# EasyEDA Pro project ProDoc_遥控_2025-09-02.epro

# Schematic Schematic1
Board Name: 遥控; Create Date: 2024-12-08; Page Name: P1; Project Name: 兽装可动眼（商用版）; Schematic Name: Schematic1; Update Date: 2024-12-22
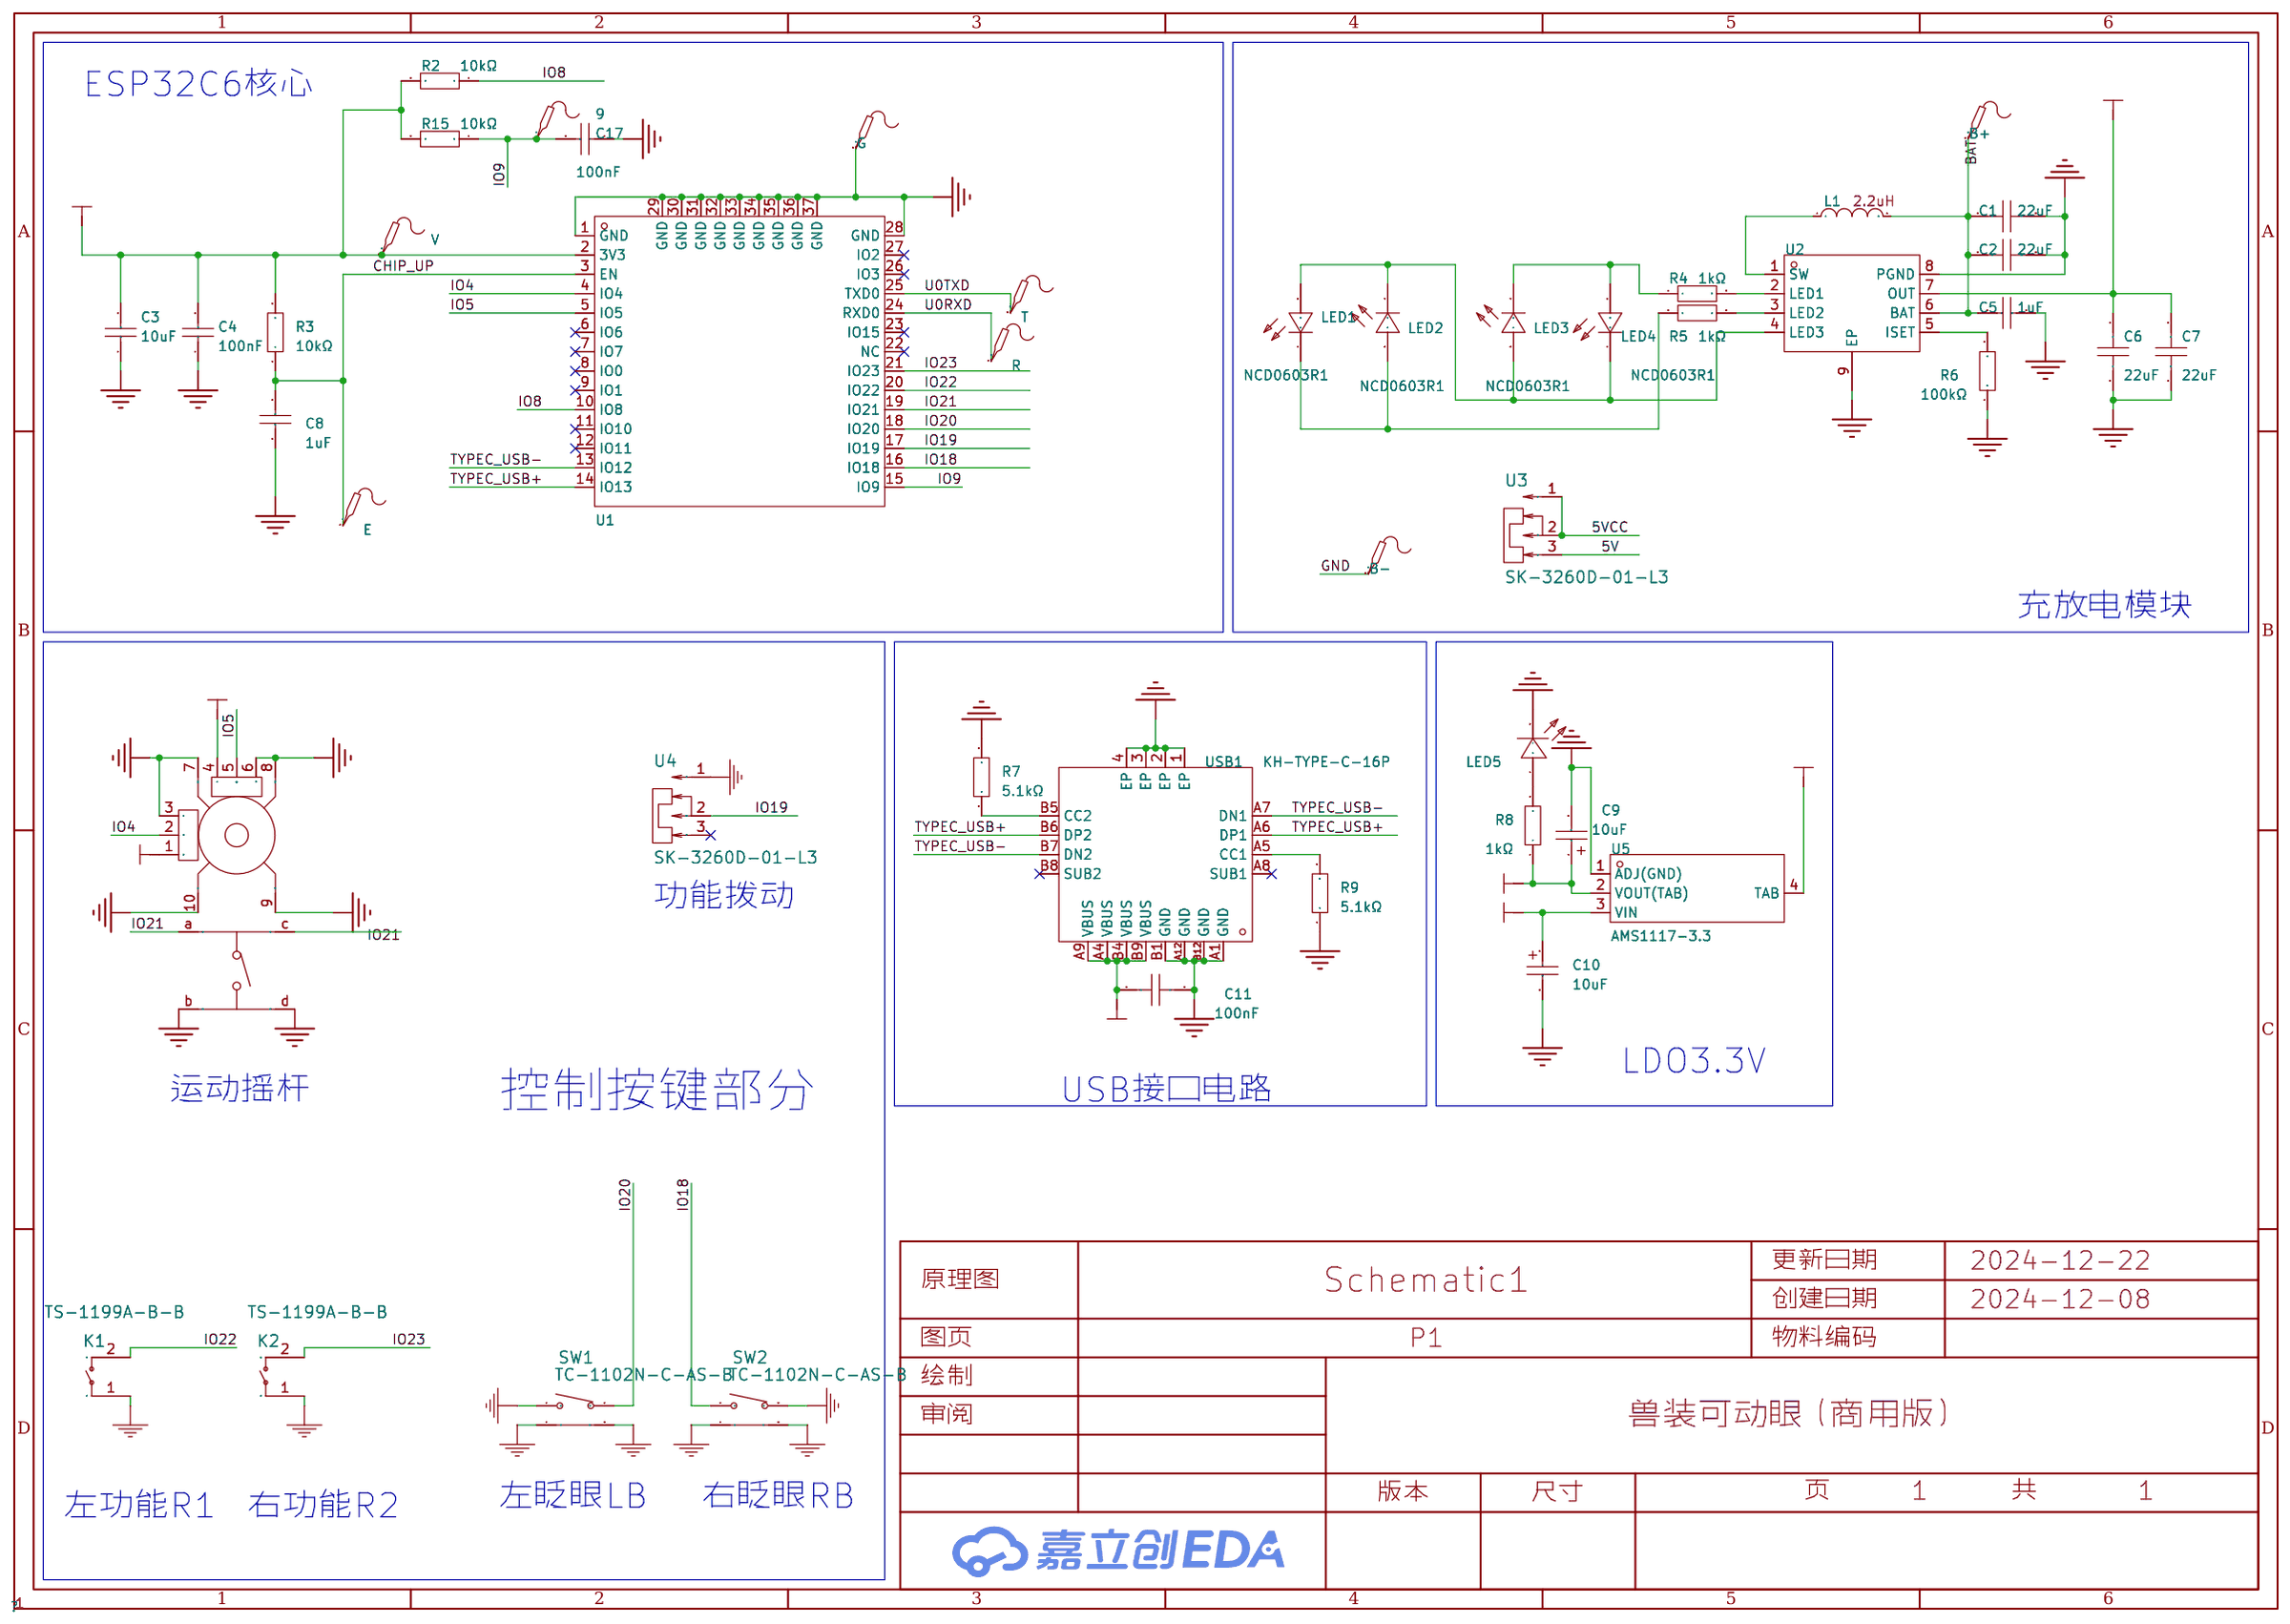
[diagram p0: schematic sheet]

## Parts
9  -  [Test-Point-0.5mm]
B+  -  [Test-Point-0.5mm]
B-  -  [Test-Point-0.5mm]
C1  22uF  [C0805]
C2  22uF  [C0805]
C3  10uF  [C0805]
C4  100nF  [C0805]
C5  1uF  [C0603]
C6  22uF  [C0805]
C7  22uF  [C0805]
C8  1uF  [C0805]
C9  10uF  [CAP-SMD_L3.2-W1.6-RD-C7171]
C10  10uF  [CAP-SMD_L3.2-W1.6-RD-C7171]
C11  100nF  [C0603]
C17  100nF  [C0805]
E  -  [Test-Point-0.5mm]
G  -  [Test-Point-0.5mm]
JOY1  RKJXV1224005  [SW-TH_RKJXV1224005]
K1  TS-1199A-B-B  [SW-SMD_L6.0-W6.0-P6.00-LS6.6]
K2  TS-1199A-B-B  [SW-SMD_L6.0-W6.0-P6.00-LS6.6]
L1  2.2uH  [IND-SMD_L5.8-W5.2]
LED1  NCD0603R1  [LED0603-RD_RED]
LED2  NCD0603R1  [LED0603-RD_RED]
LED3  NCD0603R1  [LED0603-RD_RED]
LED4  NCD0603R1  [LED0603-RD_RED]
LED5  NCD0805R1  [LED0805-R-RD]
R  -  [Test-Point-0.5mm]
R2  10kΩ  [R0805]
R3  10kΩ  [R0805]
R4  1kΩ  [R0603]
R5  1kΩ  [R0603]
R6  100kΩ  [R0603]
R7  5.1kΩ  [R0603]
R8  1kΩ  [R0805]
R9  5.1kΩ  [R0603]
R15  10kΩ  [R0805]
SW1  TC-1102N-C-AS-B  [SW-TH_TC-1102N-C-AS-B]
SW2  TC-1102N-C-AS-B  [SW-TH_TC-1102N-C-AS-B]
T  -  [Test-Point-0.5mm]
U1  ESP32-C6-WROOM-1-N8  [WIRELM-SMD_ESP32-C6-WROOM-1]
U2  ETA9740  [ESOP-8_L4.9-W3.9-P1.27-LS6.0-BL-EP]
U3  SK-3260D-01-L3  [SW-TH_SK-3260D-01-LX]
U4  SK-3260D-01-L3  [SW-TH_SK-3260D-01-LX]
U5  AMS1117-3.3  [SOT-223-4_L6.5-W3.5-P2.30-LS7.0-BR]
USB1  KH-TYPE-C-16P  [USB-C-SMD_KH-TYPE-C-16P]
V  -  [Test-Point-0.5mm]

## Library data of the parts
9 B+ B- E G R T V = Test-Point: Test Point 测试点
C1 C2 C6 C7 = CL21A226MAQNNNE_C45783: 容值:22uF;精度:±20%;额定电压:25V;材质(温度系数):X5R;; LCSC Part Name: 22uF ±20% 25V; Supplier Part: C45783; Manufacturer: SAMSUNG(三星); Manufacturer Part: CL21A226MAQNNNE; Supplier Footprint: 0805; JLCPCB Part Class: Basic Part; Datasheet: https://atta.szlcsc.com/upload/public/pdf/source/20160103/1457707727161.pdf; Supplier: LCSC; Tolerance: ±20%; Voltage Rated: 25V; Temperature Coefficient: X5R
C3 = CL21A106KOQNNNE: 容值:10uF;精度:±10%;额定电压:16V;材质(温度系数):X5R;; LCSC Part Name: 10uF ±10% 16V; Supplier Part: C1713; Manufacturer: SAMSUNG(三星); Supplier Footprint: 0805; JLCPCB Part Class: 扩展库; Datasheet: https://atta.szlcsc.com/upload/public/pdf/source/20160103/1457707694240.pdf; Supplier: LCSC; Tolerance: ±10%; Voltage Rated: 16V; Temperature Coefficient: X5R
C4 C17 = 0805B104K500NT: 容值:100nF;精度:±10%;额定电压:50V;材质(温度系数):X7R;; LCSC Part Name: 100nF ±10% 50V; Supplier Part: C38141; Manufacturer: FH(风华); Supplier Footprint: 0805; JLCPCB Part Class: 扩展库; Datasheet: https://atta.szlcsc.com/upload/public/pdf/source/20170923/C38141_1506149447419988747.pdf; Supplier: LCSC; Tolerance: ±10%; Voltage Rated: 50V; Temperature Coefficient: X7R
C5 = CL10A105KB8NNNC: 容值:1uF;精度:±10%;额定电压:50V;材质(温度系数):X5R;; LCSC Part Name: 1uF ±10% 50V; Supplier Part: C15849; Manufacturer: SAMSUNG(三星); Supplier Footprint: 0603; JLCPCB Part Class: Basic Part; Datasheet: https://atta.szlcsc.com/upload/public/pdf/source/20160103/1457707679084.pdf; Supplier: LCSC; Tolerance: ±10%; Voltage Rated: 50V; Temperature Coefficient: X5R
C8 = CL21B105KBFNNNE: 容值:1uF;精度:±10%;额定电压:50V;材质(温度系数):X7R;; LCSC Part Name: 1uF ±10% 50V; Supplier Part: C28323; Manufacturer: SAMSUNG(三星); Supplier Footprint: 0805; JLCPCB Part Class: 基础库; Datasheet: https://atta.szlcsc.com/upload/public/pdf/source/20160103/1457707718219.pdf; Supplier: LCSC; Tolerance: ±10%; Voltage Rated: 50V; Temperature Coefficient: X7R
C9 C10 = TAJA106K016RNJ: 容值:10uF;精度:±10%;额定电压:16V;等效串联电阻:3Ω@100kHz;; LCSC Part Name: 10uF ±10% 16V; Supplier Part: C7171; Manufacturer: Kyocera AVX; Supplier Footprint: CASE-A-3216; JLCPCB Part Class: 基础库; Datasheet: https://atta.szlcsc.com/upload/public/pdf/source/20160107/1457707748093.pdf; Supplier: LCSC; Tolerance: ±10%; Rated Voltage: 16V; Equivalent Series Resistance(ESR): 3Ω@100kHz; Operating Temperature: -55℃~+125℃
C11 = CC0603KRX7R9BB104: 容值:100nF;精度:±10%;额定电压:50V;材质(温度系数):X7R;; LCSC Part Name: 100nF ±10% 50V; Supplier Part: C14663; Manufacturer: YAGEO(国巨); Supplier Footprint: 0603; JLCPCB Part Class: 基础库; Datasheet: https://atta.szlcsc.com/upload/public/pdf/source/20180910/C282072_33301C7F631E79921B82A8DAC6BCC5B3.pdf; Supplier: LCSC; Tolerance: ±10%; Voltage Rated: 50V; Temperature Coefficient: X7R
JOY1 = RKJXV1224005: 操纵杆复位 中央按动开关 适用于航模玩具遥控器电位器、3D摇杆PS4手柄游戏机、无人机摇杆电位器、工业控制器; Supplier Part: C146170; Manufacturer: ALPSALPINE(阿尔卑斯阿尔派); Supplier Footprint: 插件,13x13mm; JLCPCB Part Class: Extended Part; Datasheet: https://atta.szlcsc.com/upload/public/pdf/source/20180125/C146170_15168615510911301620.pdf; Supplier: LCSC
K1 K2 = TS-1199A-B-B: 电路结构:单刀单掷;按钮形状:圆形按钮;作用力:200gf;安装方式:立贴;开关长度:6mm;开关宽度:6mm;开关高度:5mm;带支架:不带;触点电流:50mA;额定电压(DC):12V;绝缘电阻:-;带灯:无;机械寿命:10万次;; LCSC Part Name: 6*6*5mm 立贴 轻触开关; Supplier Part: C692476; Manufacturer: XKB Connectivity(中国星坤); Supplier Footprint: SMD; JLCPCB Part Class: Extended Part; Datasheet: https://atta.szlcsc.com/upload/public/pdf/source/20211011/5E46F02732EE66B7CDC1B0DB682D7B62.pdf; Supplier: LCSC; Circuit: 单刀单掷; Actuator Style: 圆形按钮; Operating Force: 200gf; Mounting Style: 立贴; Switch Length: 6mm; Switch Width: 6mm; Switch Height: 5mm; Strike Gundam: 不带; Contact Current: 50mA; Voltage Rating (DC): 12V; Actuator/Cap Color: 黑色; With Lamp: 无; Mechanical Life: 10万次; Operating Temperature: -30℃~+85℃
L1 = MDA5030-2R2M: 电感值:2.2uH;精度:±20%;额定电流:6.5A;饱和电流(Isat):6.5A;直流电阻(DCR):21.6mΩ;; LCSC Part Name: 2.2uH ±20% 6.5A; Supplier Part: C2847475; Manufacturer: KOHERelec(科或); Supplier Footprint: SMD,5.2x5.7mm; JLCPCB Part Class: Extended Part; Datasheet: https://atta.szlcsc.com/upload/public/pdf/source/20210806/C2847475_BCA7949AA3147D213A746F6BA524684A.pdf; Supplier: LCSC; Tolerance: ±20%; Rated Current: 6.5A; Saturation Current (Isat): 6.5A; DC Resistance (DCR): 21.6mΩ; Length: 5.8mm; Width: 5.2mm; Height: 4.5mm
LED1-LED4 = NCD0603R1_C84263: 灯头类型:-;发光颜色:红色;正向电压(VF):1.6V~2.6V;功率:65mW;正向电流:20mA;主波长:615nm~630nm;二极管配置:独立二极管;透镜颜色:无色透明透镜;色温:-;发光强度:80mcd~220mcd;发光角度:130°;载带方式:-;工作温度:-30℃~+85℃;; Supplier Part: C84263; Manufacturer: 国星光电; Supplier Footprint: 0603; JLCPCB Part Class: Extended Part; Datasheet: https://atta.szlcsc.com/upload/public/pdf/source/20200820/C84263_DABC6A75E58F576973B407FDBA283D60.pdf; Supplier: LCSC; Emitted Color: 红色; Forward Voltage (VF): 1.6V~2.6V; Power Dissipation: 65mW; Forward Current: 20mA; Dominant Wavelength: 615nm~630nm; Diode Configuration: 独立二极管; Lens Color: 无色透明透镜; Luminous Intensity: 80mcd~220mcd; Viewing Angle: 130°; Operating Temperature: -30℃~+85℃
LED5 = NCD0805R1: 灯头类型:-;发光颜色:红色;正向电压(VF):1.6V~2.6V;功率:65mW;正向电流:20mA;主波长:615nm~630nm;二极管配置:独立二极管;透镜颜色:无色透明透镜;色温:-;发光强度:67mcd~195mcd;发光角度:130°;载带方式:-;工作温度:-30℃~+85℃;; Supplier Part: C84256; Manufacturer: 国星光电; Supplier Footprint: 0805; JLCPCB Part Class: Basic Part; Datasheet: https://atta.szlcsc.com/upload/public/pdf/source/20200820/C84256_F0A75A43B3EAD75808600A0514C76B99.pdf; Supplier: LCSC; Emitted Color: 红色; Forward Voltage (VF): 1.6V~2.6V; Power Dissipation: 65mW; Forward Current: 20mA; Dominant Wavelength: 615nm~630nm; Diode Configuration: 独立二极管; Lens Color: 无色透明透镜; Luminous Intensity: 67mcd~195mcd; Viewing Angle: 130°; Operating Temperature: -30℃~+85℃
R2 R3 R15 = 0805W8F1002T5E_C17414: 电阻类型:厚膜电阻;阻值:10kΩ;精度:±1%;功率:125mW;; LCSC Part Name: 10kΩ ±1% 125mW; Supplier Part: C17414; Manufacturer: UNI-ROYAL(厚声); Manufacturer Part: 0805W8F1002T5E; Supplier Footprint: 0805; JLCPCB Part Class: 基础库; Datasheet: https://atta.szlcsc.com/upload/public/pdf/source/20200306/C422600_1E6D84923E4A46A82E41ADD87F860B5C.pdf; Supplier: LCSC; Type: 厚膜电阻; Tolerance: ±1%; Power(Watts): 125mW; Temperature Coefficient: ±100ppm/℃; Overload Voltage (Max): 150V; Operating Temperature Range: -55℃~+155℃
R4 R5 = 0603WAF1001T5E: 电阻类型:厚膜电阻;阻值:1kΩ;精度:±1%;功率:100mW;; LCSC Part Name: 1kΩ ±1% 100mW; Supplier Part: C21190; Manufacturer: UNI-ROYAL(厚声); Supplier Footprint: 0603; JLCPCB Part Class: Basic Part; Datasheet: https://atta.szlcsc.com/upload/public/pdf/source/20200306/C422600_1E6D84923E4A46A82E41ADD87F860B5C.pdf; Supplier: LCSC; Type: 厚膜电阻; Tolerance: ±1%; Power(Watts): 100mW; Temperature Coefficient: ±100ppm/℃; Overload Voltage (Max): 75V; Operating Temperature Range: -55℃~+155℃
R6 = 0603WAF1003T5E: 电阻类型:厚膜电阻;阻值:100kΩ;精度:±1%;功率:100mW;; LCSC Part Name: 100kΩ ±1% 100mW; Supplier Part: C25803; Manufacturer: UNI-ROYAL(厚声); Supplier Footprint: 0603; JLCPCB Part Class: Basic Part; Datasheet: https://atta.szlcsc.com/upload/public/pdf/source/20200306/C422600_1E6D84923E4A46A82E41ADD87F860B5C.pdf; Supplier: LCSC; Type: 厚膜电阻; Tolerance: ±1%; Power(Watts): 100mW; Temperature Coefficient: ±100ppm/℃; Overload Voltage (Max): 75V; Operating Temperature Range: -55℃~+155℃
R7 R9 = 0603WAF5101T5E: 电阻类型:厚膜电阻;阻值:5.1kΩ;精度:±1%;功率:100mW;最大工作电压:75V;温度系数:±100ppm/℃;; LCSC Part Name: 5.1kΩ ±1% 100mW 厚膜电阻; Supplier Part: C23186; Manufacturer: UNI-ROYAL(厚声); Supplier Footprint: 0603; JLCPCB Part Class: 基础库; Datasheet: https://atta.szlcsc.com/upload/public/pdf/source/20200306/C422600_1E6D84923E4A46A82E41ADD87F860B5C.pdf; Supplier: LCSC; Type: 厚膜电阻; Tolerance: ±1%; Power(Watts): 100mW; Overload Voltage (Max): 75V; Temperature Coefficient: ±100ppm/℃; Operating Temperature Range: -55℃~+155℃
R8 = RC0805FR-071KL: 电阻类型:厚膜电阻;阻值:1kΩ;精度:±1%;功率:125mW;; LCSC Part Name: 1kΩ ±1% 125mW; Supplier Part: C95781; Manufacturer: YAGEO(国巨); Supplier Footprint: 0805; JLCPCB Part Class: 扩展库; Datasheet: https://atta.szlcsc.com/upload/public/pdf/source/20170228/1488267679154.pdf; Supplier: LCSC; Type: 厚膜电阻; Tolerance: ±1%; Power(Watts): 125mW; Temperature Coefficient: ±100ppm/℃; Overload Voltage (Max): 150V; Operating Temperature Range: -55℃~+155℃
SW1 SW2 = TC-1102N-C-AS-B: 电路结构:单刀单掷;按钮形状:圆形按钮;作用力:260gf;安装方式:卧插;开关长度:6mm;开关宽度:6mm;开关高度:4.5mm;带支架:带支架;触点电流:50mA;额定电压(DC):12V;绝缘电阻:-;带灯:无;机械寿命:30万次;; LCSC Part Name: 6*6*4.5mm 卧插 轻触开关; Supplier Part: C406151; Manufacturer: XKB Connectivity(中国星坤); Supplier Footprint: 插件; JLCPCB Part Class: Extended Part; Datasheet: https://atta.szlcsc.com/upload/public/pdf/source/20211011/8943A334D21548136505FDDC6F7285B9.pdf; Supplier: LCSC; Circuit: 单刀单掷; Actuator Style: 圆形按钮; Operating Force: 260gf; Mounting Style: 卧插; Switch Length: 6mm; Switch Width: 6mm; Switch Height: 4.5mm; Strike Gundam: 带支架; Contact Current: 50mA; Voltage Rating (DC): 12V; Actuator/Cap Color: 黑色; With Lamp: 无; Pin Style: PC引脚; Mechanical Life: 30万次; Operating Temperature: -30℃~+85℃
U1 = ESP32-C6-WROOM-1-N8: Supplier Part: C5366877; Manufacturer: ESPRESSIF(乐鑫); JLCPCB Part Class: Extended Part; Datasheet: https://atta.szlcsc.com/upload/public/pdf/source/20241030/28A96DE7ADA92974C13AF543C219F785.pdf; Supplier: LCSC
U2 = ETA9740: Supplier Part: C2892884; Supplier Footprint: ESOP-8EP(4.9x3.9x1.27); JLCPCB Part Class: 扩展库; Datasheet: 2021-09-02/679003A/644f31485bf644619c02e5e95628f4a9/20160908126263.pdf; Supplier: LCSC
U3 U4 = SK-3260D-01-L3: 电路结构:单刀双掷;安装方式:侧插;开关颜色:黑色;额定电流(DC):50mA;额定电压(DC):12V;额定电流(AC):50mA;额定电压(AC):12V;机械寿命:1万次;; LCSC Part Name: 柄长3mm 卧插双档 滑动开关; Supplier Part: C692482; Manufacturer: XKB Connectivity(中国星坤); Supplier Footprint: 插件; JLCPCB Part Class: Extended Part; Datasheet: https://atta.szlcsc.com/upload/public/pdf/source/20211009/221EDC0F79A971BF29F08D53B29B73D7.pdf; Supplier: LCSC; Circuit: 单刀双掷; Actuator Style: 矩形柱状; Pin Style: PC引脚; Switch Length: 9mm; Switch Width: 3.2mm; Switch Height: 3.6mm; Mounting Style: 侧插; Actuator Color: 黑色; Current Rating (DC): 50mA; Voltage Rating (DC): 12V; Current Rating (AC): 50mA; Voltage Rating (AC): 12V; Mechanical Life: 1万次; Operating Temperature: -40℃~+85℃
U5 = AMS1117-3.3_C347222: 输出类型:固定;最大输入电压:18V;输出电压:3.3V;输出电流:1A;电源纹波抑制比(PSRR):60dB@(120Hz);输出极性:正极;; LCSC Part Name: 输出:3.3V 电流:1A 耐压:12V; Supplier Part: C347222; Manufacturer: UMW(友台半导体); Supplier Footprint: SOT-223; JLCPCB Part Class: Extended Part; Datasheet: https://atta.szlcsc.com/upload/public/pdf/source/20231109/155D79A26D9DB04352555A58D5969DC8.pdf; Supplier: LCSC; Output Type: 固定; Output Polarity: 正极; Number of Outputs: 1; Maximum Input Voltage: 18V; Output Voltage: 3.3V; Dropout Voltage: 1.3V@(1A); Output Current: 1A; Power Supply Rejection Ratio (PSRR): 60dB@(120Hz); Feature: 过流保护(OCP)
USB1 = KH-TYPE-C-16P: 连接器类型:Type-C;标准:-;公母:母座;触点数量:16;端口数量:1;安装方式:卧贴;额定电流 - 电源:3A;工作温度范围:-40℃~+85℃;; LCSC Part Name: Type-C 母座 卧贴; Supplier Part: C709357; Manufacturer: kinghelm(金航标); Supplier Footprint: SMD; JLCPCB Part Class: 扩展库; Datasheet: https://atta.szlcsc.com/upload/public/pdf/source/20200911/C709357_AA8DCEB38BB20E3035A7ED7AE7667837.pdf; Supplier: LCSC; Connector Type: Type-C; Gender: 母座; Number of Contacts: 16; Number of Ports: 1; Mounting Style: 卧贴; Current Rating - Power (Max): 3A; Operating Temperature Range: -40℃~+85℃

## Nets
3V3: C3.2 C4.2 C9.1 JOY1.1(B) JOY1.4(A) R2.2 R3.2 R8.1 R15.2 U1.2(3V3) U5.2(VOUT(TAB)) U5.4(TAB) V.1
5V: C6.1 C7.2 C11.2 U2.7(OUT) U3.3 USB1.A4(VBUS) USB1.A9(VBUS) USB1.B4(VBUS) USB1.B9(VBUS)
5VCC: C10.1 U3.1 U3.2 U5.3(VIN)
GND: B-.1 C1.2 C2.2 C3.1 C4.1 C5.2 C6.2 C7.1 C8.1 C9.2 C10.2 C11.1 C17.1 G.1 JOY1.3(A) JOY1.6(B) JOY1.7(GND) JOY1.8(GND) JOY1.9(GND) JOY1.10(GND) JOY1.b JOY1.d K1.1 K2.1 LED5.2(-) R6.1 R7.2 R9.1 SW1.1 SW1.3 SW1.4 SW2.2 SW2.3 SW2.4 U1.1(GND) U1.28(GND) U1.29(GND) U1.30(GND) U1.31(GND) U1.32(GND) U1.33(GND) U1.34(GND) U1.35(GND) U1.36(GND) U1.37(GND) U2.8(PGND) U2.9(EP) U4.1 U5.1(ADJ(GND)) USB1.1(EP) USB1.2(EP) USB1.3(EP) USB1.4(EP) USB1.A1(GND) USB1.A12(GND) USB1.B1(GND) USB1.B12(GND)
BAT: B+.1 C1.1 C2.1 C5.1 L1.2 U2.6(BAT)
CHIP_UP: C8.2 E.1 R3.1 U1.3(EN)
IO4: JOY1.2(DTA) U1.4(IO4)
IO5: JOY1.5(DTA) U1.5(IO5)
IO8: R2.1 U1.10(IO8)
IO9: 9.1 C17.2 R15.1 U1.15(IO9)
IO18: SW2.1 U1.16(IO18)
IO19: U1.17(IO19) U4.2
IO20: SW1.2 U1.18(IO20)
IO21: JOY1.a JOY1.c U1.19(IO21)
IO22: K1.2 U1.20(IO22)
IO23: K2.2 U1.21(IO23)
TYPEC_USB+: U1.14(IO13) USB1.A6(DP1) USB1.B6(DP2)
TYPEC_USB-: U1.13(IO12) USB1.A7(DN1) USB1.B7(DN2)
U0RXD: R.1 U1.24(RXD0)
U0TXD: T.1 U1.25(TXD0)
$1N2410: LED5.1(+) R8.2
$1N3847: R9.2 USB1.A5(CC1)
$1N3906: R7.1 USB1.B5(CC2)
$1N6588: R6.2 U2.5(ISET)
$1N6592: R5.2 U2.3(LED2)
$1N6593: LED1.1(K) LED2.2(A) R5.1
$1N6594: L1.1 U2.1(SW)
$1N6595: LED1.2(A) LED2.1(K) LED3.2(A) LED4.1(K) U2.4(LED3)
$1N6596: LED3.1(K) LED4.2(A) R4.1
$1N6597: R4.2 U2.2(LED1)

Not connected (* = marked no-connect by the designer): U1 6(IO6)* 7(IO7)* 8(IO0)* 9(IO1)* 11(IO10)* 12(IO11)* 22(NC)* 23(IO15)* 26(IO3)* 27(IO2)*; U4 3*; USB1 A8(SUB1)* B8(SUB2)*

## Notes on the sheet
- ESP32C6核心
- 充放电模块
- 功能拨动
- LDO3.3V
- 运动摇杆
- 控制按键部分
- USB接口电路
- 左功能R1
- 右功能R2
- 左眨眼LB
- 右眨眼RB

# Board PCB1
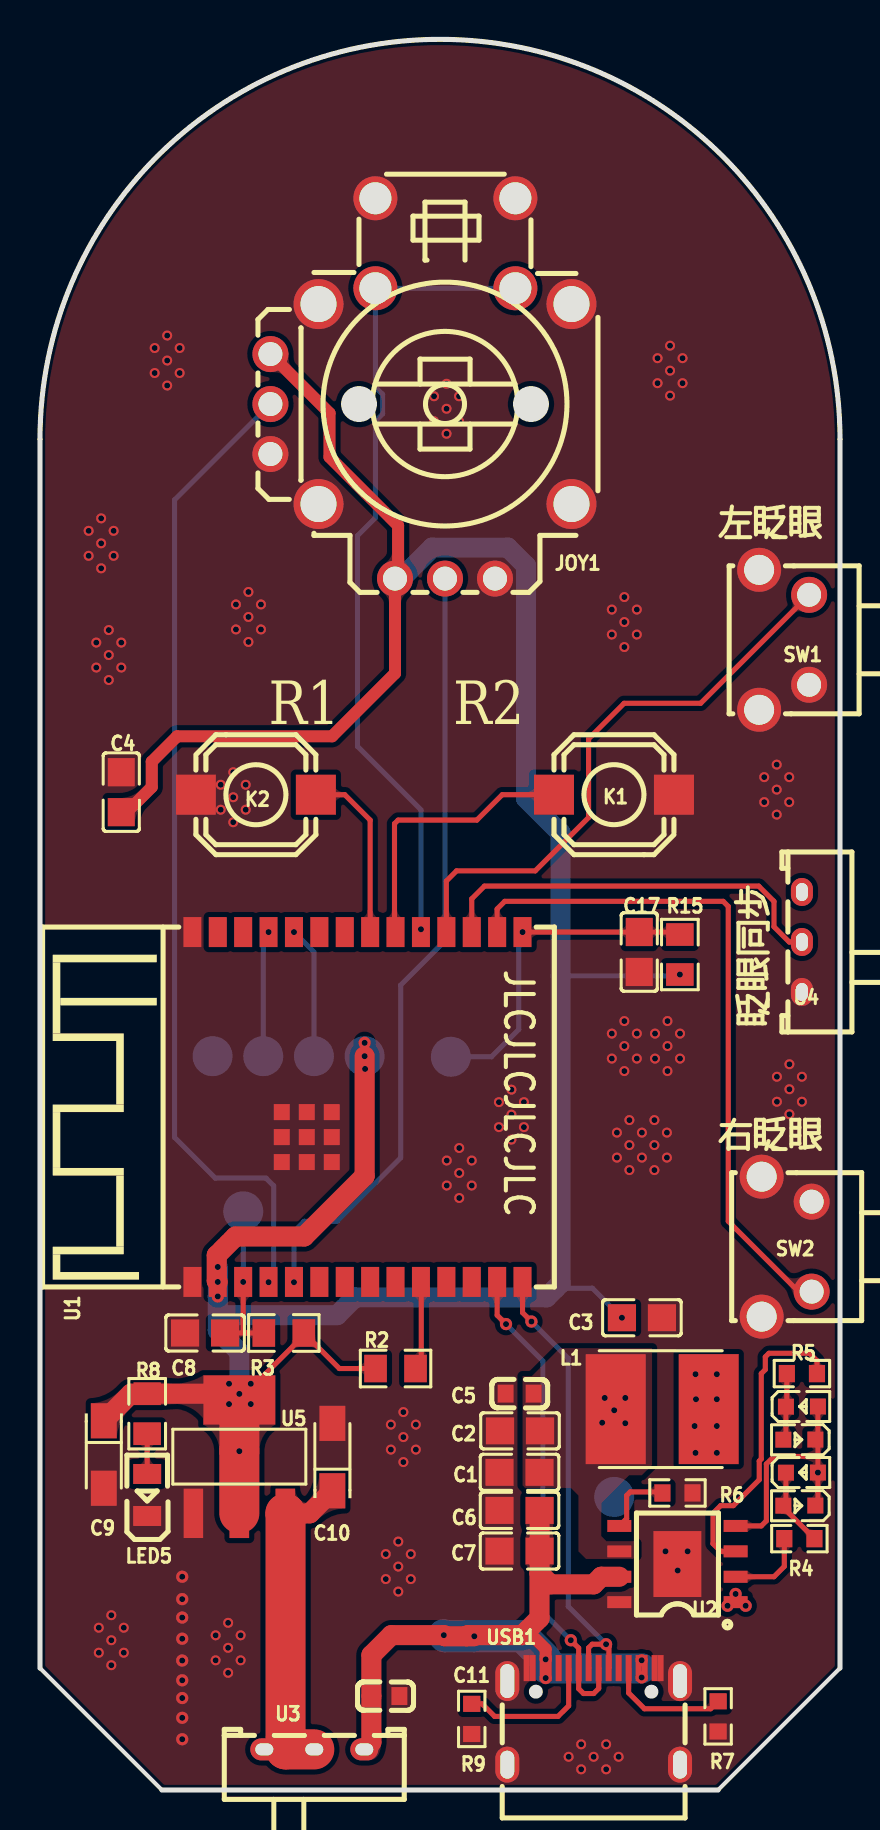
[diagram p1: board, top side]
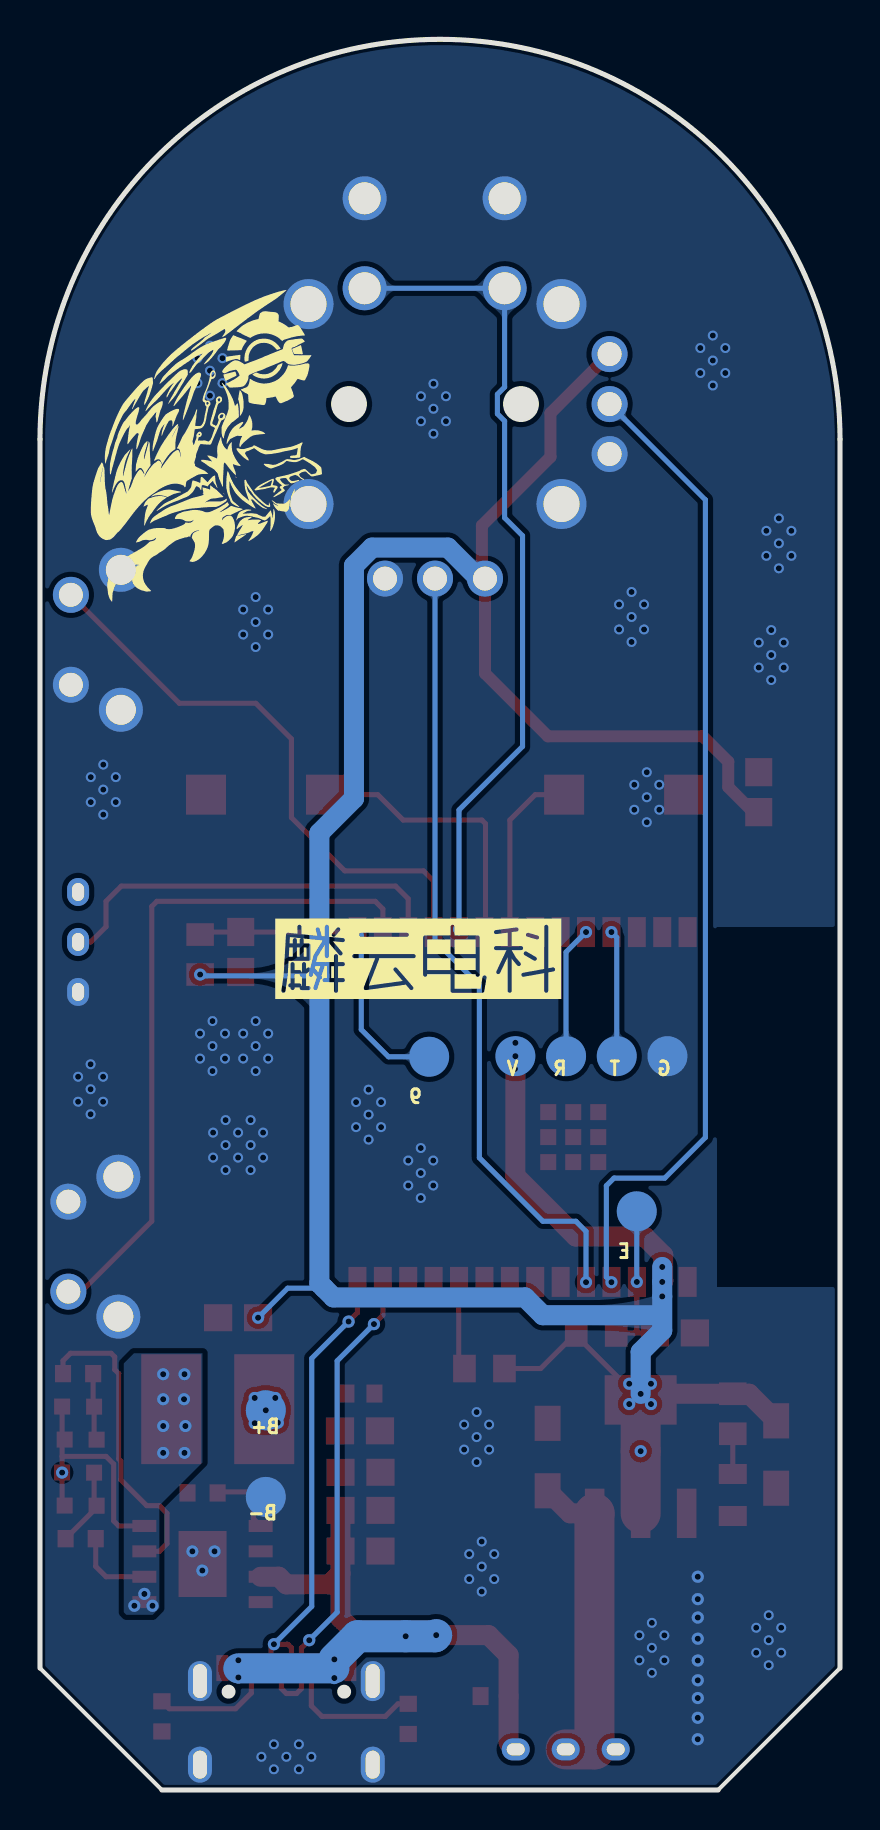
[diagram p2: board, bottom side, seen from below]

Outline 40 x 87.53 mm; copper layers: Top Layer, Bottom Layer. Coordinates in mm from the lower left corner of the outline.
Outline path: 0,67.56 arc(20,87.53) 40,67.56 40,6.1 33.91,0 6.1,0 0,6.1 0,67.56
Stack: Top Layer 0.035mm / Dielectric1 1.51mm FR4 er 4.5 / Bottom Layer 0.035mm

## Design rules (mm)
template: 自定义配置
spacing copperThickness1oz (default): track to track 0.102, other pairs 0.152 to 0.3
spacing copperThickness2oz: track to track 0.203, other pairs 0.152 to 0.3
track width copperThickness1oz (default): min 0.127, default 0.254, max 2.54
track width copperThickness2oz: min 0.203, default 0.254, max 2.54
differential pair differentialPair (default): width min 0.127, default 0.254, max 2.54; gap min 0.152, default 0.152
via viaSize (default): diameter min 0.5, default 0.61, max 10; hole min 0.3, default 0.305, max 6.3

## Placement (name value [footprint] x y rotation side)
9  -  [Test-Point-0.5mm]  20.55 36.68 180 top
B+  -  [Test-Point-0.5mm]  28.71 18.99 180 top
B-  -  [Test-Point-0.5mm]  28.71 14.66 180 top
C1  22uF  [C0805]  23.98 15.89 180 top
C2  22uF  [C0805]  24 17.97 180 top
C3  10uF  [C0805]  30.1 23.62 180 top
C4  100nF  [C0805]  4.06 49.91 270 top
C5  1uF  [C0603]  23.98 19.83 180 top
C6  22uF  [C0805]  23.98 13.99 180 top
C7  22uF  [C0805]  23.98 11.95 0 top
C8  1uF  [C0805]  8.25 22.86 0 top
C9  10uF  [CAP-SMD_L3.2-W1.6-RD-C7171]  3.19 16.78 270 top
C10  10uF  [CAP-SMD_L3.2-W1.6-RD-C7171]  14.62 16.65 90 top
C11  100nF  [C0603]  17.27 4.7 180 top
C17  100nF  [C0805]  29.97 41.92 90 top
E  -  [Test-Point-0.5mm]  10.16 28.95 180 top
G  -  [Test-Point-0.5mm]  8.63 36.71 180 top
JOY1  RKJXV1224005  [SW-TH_RKJXV1224005]  19.05 70.1 180 top
K1  TS-1199A-B-B  [SW-SMD_L6.0-W6.0-P6.00-LS6.6]  28.7 49.78 180 top
K2  TS-1199A-B-B  [SW-SMD_L6.0-W6.0-P6.00-LS6.6]  10.8 49.78 0 top
L1  2.2uH  [IND-SMD_L5.8-W5.2]  31.12 19.05 0 top
LED1  NCD0603R1  [LED0603-RD_RED]  38.1 19.18 0 top
LED2  NCD0603R1  [LED0603-RD_RED]  37.97 17.53 180 top
LED3  NCD0603R1  [LED0603-RD_RED]  38.1 15.88 0 top
LED4  NCD0603R1  [LED0603-RD_RED]  37.97 14.22 180 top
LED5  NCD0805R1  [LED0805-R-RD]  5.36 14.76 90 top
R  -  [Test-Point-0.5mm]  13.7 36.71 180 top
R2  10kΩ  [R0805]  17.78 21.08 180 top
R3  10kΩ  [R0805]  12.19 22.86 0 top
R4  1kΩ  [R0603]  37.97 12.57 180 top
R5  1kΩ  [R0603]  38.1 20.83 0 top
R6  100kΩ  [R0603]  31.88 14.86 180 top
R7  5.1kΩ  [R0603]  33.91 3.68 270 top
R8  1kΩ  [R0805]  5.36 18.82 270 top
R9  5.1kΩ  [R0603]  21.59 3.56 90 top
R15  10kΩ  [R0805]  32 41.79 270 top
SW1  TC-1102N-C-AS-B  [SW-TH_TC-1102N-C-AS-B]  37.21 57.53 90 top
SW2  TC-1102N-C-AS-B  [SW-TH_TC-1102N-C-AS-B]  37.34 27.18 90 top
T  -  [Test-Point-0.5mm]  11.16 36.71 180 top
U1  ESP32-C6-WROOM-1-N8  [WIRELM-SMD_ESP32-C6-WROOM-1]  15.88 34.16 90 top
U2  ETA9740  [ESOP-8_L4.9-W3.9-P1.27-LS6.0-BL-EP]  31.88 11.3 90 top
U3  SK-3260D-01-L3  [SW-TH_SK-3260D-01-LX]  13.72 2.03 0 top
U4  SK-3260D-01-L3  [SW-TH_SK-3260D-01-LX]  38.1 42.42 90 top
U5  AMS1117-3.3  [SOT-223-4_L6.5-W3.5-P2.30-LS7.0-BR]  9.97 16.67 270 top
USB1  KH-TYPE-C-16P  [USB-C-SMD_KH-TYPE-C-16P]  27.69 3.68 0 top
V  -  [Test-Point-0.5mm]  16.23 36.71 180 top

## Footprints (pads in the part's own frame, mm; a bottom-side part is the same pattern mirrored in y, then rotated)
C0603
  rect 0.8x0.9 smd: 1(-0.7,0) 2(0.7,0)
C0805
  rect 1.41x1.35 smd: 1(-1,0) 2(1,0)
CAP-SMD_L3.2-W1.6-RD-C7171
  rect 1.758x1.296 smd: 1(-1.687,0) 2(1.687,0)
ESOP-8_L4.9-W3.9-P1.27-LS6.0-BL-EP
  rect 0.6x1.2 smd: 1(-1.905,-2.909) 2(-0.635,-2.909) 3(0.635,-2.909) 4(1.905,-2.909) 5(1.905,2.909) 6(0.635,2.909) 7(-0.635,2.909) 8(-1.905,2.909)
  rect 3.3x2.4 smd: 9(0,0)
IND-SMD_L5.8-W5.2
  rect 3x5.5 smd: 1(2.325,0) 2(-2.325,0)
LED0603-RD_RED
  rect 0.8x0.8 smd: 1(-0.799,-0.004) 2(0.799,0.004)
LED0805-R-RD
  rect 1x1.399 smd: 1(1.05,0) 2(-1.05,0)
R0603
  rect 0.806x0.864 smd: 1(-0.753,0) 2(0.753,0)
R0805
  rect 1.133x1.377 smd: 1(-1,0) 2(1,0)
SOT-223-4_L6.5-W3.5-P2.30-LS7.0-BR
  rect 2.47x0.98 smd: 1(2.835,-2.3) 2(2.835,0) 3(2.835,2.3)
  rect 2.47x3.6 smd: 4(-2.835,0)
SW-SMD_L6.0-W6.0-P6.00-LS6.6
  rect 2x2 smd: 1(-3,0) 2(3,0)
SW-TH_RKJXV1224005
  round 1.8 hole 1.2: 1(7.527,-1.719) 2(7.527,0.781) 3(7.527,3.281) 4(1.298,9.511) 5(-1.202,9.511) 6(-3.703,9.511)
  round 2.5 hole 1.8: 7(-7.527,5.781) 8(-7.527,-4.219) 9(5.122,-4.219) 10(5.122,5.781)
  round 2.2 hole 1.6: a(-4.721,-5.011) b(-4.721,-9.511) c(2.279,-5.011) d(2.279,-9.511)
SW-TH_SK-3260D-01-LX
  oval 1.4x1.1 hole 0.9x0.6: 1(-2.5,0) 2(0,0) 3(2.5,0)
SW-TH_TC-1102N-C-AS-B
  round 1.8 hole 1.2: 1(-2.25,-1.25) 2(2.25,-1.25)
  round 2.2 hole 1.5: 3(3.5,1.25) 4(-3.5,1.25)
Test-Point-0.5mm
  round 2 smd far side: 1(0,0)
USB-C-SMD_KH-TYPE-C-16P
  oval 1.2x2 hole 0.7x1.7: 1(-4.32,1.765) 2(4.32,1.765)
  oval 1.2x1.8 hole 0.7x1.4: 3(-4.32,-2.415) 4(4.32,-2.415)
  rect 0.3x1.3 smd: A1(-3.35,2.415) A4(-2.55,2.415) A5(-1.25,2.415) A6(-0.25,2.415) A7(0.25,2.415) A8(1.25,2.415) A9(2.55,2.415) A12(3.35,2.415) B1(3.05,2.415) B4(2.25,2.415) B5(1.75,2.415) B6(0.75,2.415) B7(-0.75,2.415) B8(-1.75,2.415) B9(-2.25,2.415) B12(-3.05,2.415)
WIRELM-SMD_ESP32-C6-WROOM-1
  rect 1.5x0.9 smd: 1(-8.75,8.255) 2(-8.75,6.985) 3(-8.75,5.715) 4(-8.75,4.445) 5(-8.75,3.175) 6(-8.75,1.905) 7(-8.75,0.635) 8(-8.75,-0.635) 9(-8.75,-1.905) 10(-8.75,-3.175) 11(-8.75,-4.445) 12(-8.75,-5.715) 13(-8.75,-6.985) 14(-8.75,-8.255) 15(8.75,-8.255) 16(8.75,-6.985) 17(8.75,-5.715) 18(8.75,-4.445) 19(8.75,-3.175) 20(8.75,-1.905) 21(8.75,-0.635) 22(8.75,0.635) 23(8.75,1.905) 24(8.75,3.175) 25(8.75,4.445) 26(8.75,5.715) 27(8.75,6.985) 28(8.75,8.255)
  rect 0.8x0.8 smd: 29(-2.755,3.785) 30(-1.505,3.785) 31(-0.255,3.785) 32(-0.255,2.535) 33(-1.505,2.535) 34(-2.755,2.535) 35(-2.755,1.285) 36(-1.505,1.285) 37(-0.255,1.285)

## Nets
As in the schematic.

Pads without a net: U1 6 7 8 9 11 12 22 23 26 27; U4 3; USB1 A8 B8

## Via types
v1: diameter 0.5, hole 0.3, Top Layer to Bottom Layer, 145 vias
v2: diameter 0.61, hole 0.305, Top Layer to Bottom Layer, 60 vias

## Routing (per net, layer and track width the routed paths; a pad name or vN(x,y) marks a point on that pad's centre or on a via; arc(x,y) is an arc through that point)
3V3: length 153.6
  Top Layer w0.254: v2(16.23,37.37) v2(16.23,36.71) ; R2.2 14.97,21.08 R3.2 13.19,22.73 U5.4
  Top Layer w0.6: C4.2 4.33,48.91 5.59,50.17 5.59,51.44 6.86,52.71 14.61,52.71 17.75,55.85 JOY1.4 17.91,60.75 17.91,63.25 14.48,66.68 14.48,68.87 JOY1.1
  Top Layer w1: U5.4 9.66,19.82 R8.1 4.55,19.82 C9.1 ; v2(16.23,36.71) 16.23,30.71 13.21,27.69 9.78,27.69 8.84,26.74 8.84,25.47 v2(8.89,25.41)
  Top Layer w2: U5.4 v2(9.97,16.95) U5.2
  Bottom Layer w0.254: 26.03,40.72 31.93,40.72 v2(32,40.79) ; v2(29.1,23.62) 27.62,25.1 25.79,25.1
  Bottom Layer w1: JOY1.4 18.06,60.59 19.61,62.15 23.4,62.15 24.3,61.24 24.3,49.59 26.03,47.86 26.03,25.34 25.33,24.64 15.75,24.64 14.86,23.75 9.14,23.75 ; v2(9.97,19.81) 9.97,21.91 8.89,22.99 v2(8.89,24.69) v2(8.89,25.41) v2(8.89,26.16)
  vias: v2(9.45,20.32) v2(9.45,19.3) v2(10.54,20.32) v2(10.54,19.3) v2(16.26,36.07)
5V: length 38.7
  Top Layer w0.254: v2(25.29,6.53) v2(25.29,5.6)
  Top Layer w0.6: v2(25.29,6.53) 25.29,7.05 24.36,7.98
  Top Layer w1: U3.3 16.57,2.39 C11.2 16.57,6.75 17.57,7.75 v2(20.19,7.75) 20.25,7.69 21.34,7.69 ; 24.98,10.83 C7.2 C6.1 ; 24.98,10.83 25.53,10.29 27.69,10.29 28.07,10.67 U2.7 ; 24.98,10.83 24.98,8.6 24.13,7.75 21.4,7.75 21.34,7.69 ; 21.34,7.69 v2(21.72,7.69)
  Bottom Layer w0.254: v2(30.09,6.49) v2(30.09,5.63) ; 25.29,6.09 v2(25.29,5.6)
  Bottom Layer w1.5: 30.09,6.09 25.29,6.09
  Bottom Layer w1.6: v2(20.19,7.75) 20.25,7.69 v2(21.72,7.69) 24.13,7.69 v2(25.29,6.53)
5VCC: length 17.1
  Top Layer w0.254: 12.28,2.03 U3.1
  Top Layer w1: U5.3 13.49,13.84 C10.1
  Top Layer w2: U3.2 12.28,2.03 12.28,13.83 U5.3
GND:
  vias: v1(2.43,62.98) v1(2.43,61.73) v1(2.81,57.39) v1(2.81,56.14) v1(2.94,8.12) v1(2.94,6.87) v1(3.06,63.61) v1(3.06,62.36) v1(3.06,61.11) v1(3.44,58.02) v1(3.44,56.77) v1(3.44,55.52) v1(3.57,8.74) v1(3.57,7.49) v1(3.57,6.24) v1(3.68,62.98) v1(3.68,61.73) v1(4.06,57.39) v1(4.06,56.14) v1(4.19,8.12) v1(4.19,6.87) v1(5.74,72.13) v1(5.74,70.88) v1(6.36,72.75) v1(6.36,71.5) v1(6.36,70.25) v1(6.99,72.13) v1(6.99,70.88) v1(8.78,7.74) v1(8.78,6.49) v1(9.04,50.28) v1(9.04,49.03) v1(9.41,8.36) v1(9.41,7.11) v1(9.41,5.86) v1(9.66,50.91) v1(9.66,49.66) v1(9.66,48.41) v1(9.8,59.3) v1(9.8,58.05) v1(10.03,7.74) v1(10.03,6.49) v1(10.29,50.28) v1(10.29,49.03) v1(10.42,59.92) v1(10.42,58.67) v1(10.42,57.42) v1(11.05,59.3) v1(11.05,58.05) v1(17.29,11.8) v1(17.29,10.55) v1(17.55,18.28) v1(17.55,17.03) v1(17.92,12.43) v1(17.92,11.18) v1(17.92,9.93) v1(18.17,18.9) v1(18.17,17.65) v1(18.17,16.4) v1(18.54,11.8) v1(18.54,10.55) v1(18.8,18.28) v1(18.8,17.03) v1(19.71,69.71) v1(19.71,68.46) v1(20.33,70.34) v1(20.33,69.09) v1(20.33,67.84) v1(20.34,31.49) v1(20.34,30.24) v1(20.96,69.71) v1(20.96,68.46) v1(20.97,32.11) v1(20.97,30.86) v1(20.97,29.61) v1(21.59,31.49) v1(21.59,30.24) v1(22.95,34.41) v1(22.95,33.16) v1(23.57,35.03) v1(23.57,33.78) v1(23.57,32.53) v1(24.2,34.41) v1(24.2,33.16) v1(26.44,1.66) v1(27.06,2.29) v1(27.06,1.04) v1(27.69,1.66) v1(28.31,2.29) v1(28.31,1.04) v1(28.59,59.05) v1(28.59,57.8) v1(28.59,37.84) v1(28.59,36.59) v1(28.85,32.88) v1(28.85,31.63) v1(28.94,1.66) v1(29.22,59.67) v1(29.22,58.42) v1(29.22,57.17) v1(29.22,38.46) v1(29.22,37.21) v1(29.22,35.96) v1(29.47,33.51) v1(29.47,32.26) v1(29.47,31.01) v1(29.84,59.05) v1(29.84,57.8) v1(29.84,37.84) v1(29.84,36.59) v1(30.1,32.88) v1(30.1,31.63) v1(30.75,37.84) v1(30.75,36.59) v1(30.72,33.51) v1(30.72,32.26) v1(30.72,31.01) v1(30.88,71.62) v1(30.88,70.37) v1(31.38,38.46) v1(31.38,37.21) v1(31.38,35.96) v1(31.35,32.88) v1(31.35,31.63) v1(31.51,72.24) v1(31.51,70.99) v1(31.51,69.74) v1(32,37.84) v1(32,36.59) v1(32.13,71.62) v1(32.13,70.37) v1(36.22,50.66) v1(36.22,49.41) v1(36.84,51.29) v1(36.84,50.04) v1(36.84,48.79) v1(36.85,35.68) v1(36.85,34.43) v1(37.47,50.66) v1(37.47,49.41) v1(37.47,36.3) v1(37.47,35.05) v1(37.47,33.8) v1(38.1,35.68) v1(38.1,34.43) v2(7.11,10.67) v2(7.11,9.55) v2(7.11,8.63) v2(7.11,7.57) v2(7.11,6.48) v2(7.11,5.49) v2(7.11,4.6) v2(7.11,3.61) v2(7.11,2.54) v2(31.28,11.94) v2(31.89,10.98) v2(32.39,11.94)
BAT:
  vias: v2(28.11,18.37) v2(28.24,19.61) v2(28.71,18.99) v2(29.27,19.61) v2(29.27,18.35)
CHIP_UP: length 8.1
  Top Layer w0.254: 10.29,22.86 10.16,22.99 v2(10.16,25.41) ; 10.29,22.86 C8.2 ; 10.29,22.86 R3.1
  Bottom Layer w0.254: E.1 10.16,25.4
IO4: length 49.6
  Bottom Layer w0.254: JOY1.2 6.73,64.53 6.73,32.64 8.76,30.61 11.3,30.61 11.68,30.23 11.68,25.65 v2(11.43,25.4)
IO5: length 39.3
  Bottom Layer w0.254: JOY1.5 20.25,42.48 18.03,40.26 18.03,31.62 14.86,28.45 13.21,28.45 12.7,27.94 v2(12.7,25.4)
IO8: length 4.5
  Top Layer w0.254: U1.10 19.07,25.4 19.07,21.37 R2.1
IO9: length 16.8
  Top Layer w0.254: R15.1 31.87,42.91 v2(24.13,42.91)
  Bottom Layer w0.254: 24.13,42.93 23.94,42.74 23.94,38.04 22.58,36.68 9.1
IO18: length 34.4
  Top Layer w0.254: SW2.1 37.94,24.93 34.42,28.45 34.42,44.2 34.16,44.45 23.24,44.45 22.86,44.07 U1.16
IO19: length 20.3
  Top Layer w0.254: U4.2 37.47,42.42 36.7,43.18 36.7,44.45 35.94,45.21 22.22,45.21 21.59,44.58 U1.17
IO20: length 28.9
  Top Layer w0.254: U1.18 20.32,45.47 20.83,45.97 24.77,45.97 27.43,48.64 27.43,52.58 29.21,54.36 33.04,54.36 SW1.2
IO21: length 41
  Bottom Layer w0.254: JOY1.a JOY1.c 16.77,70.17 17.13,69.81 17.13,68.83 16.77,68.47 16.77,63.63 15.88,62.74 15.88,52.2 19.05,49.02 v2(19.05,43.05)
IO22: length 14
  Top Layer w0.254: U1.20 17.73,42.97 17.73,48.33 17.91,48.51 21.84,48.51 23.11,49.78 K1.2
IO23: length 8.8
  Top Layer w0.254: U1.21 16.51,48.51 15.24,49.78 K2.2
TYPEC_USB+: length 23.1
  Top Layer w0.254: U1.14 24.13,23.88 v2(24.57,23.43) ; 28.44,6.1 28.45,6.11 28.45,7.15 v2(28.31,7.29) 27.61,7.29 27.43,7.11 27.43,6.1 27.44,6.1
  Bottom Layer w0.254: v2(28.31,7.29) 26.42,9.18 26.42,21.59 v2(24.57,23.43)
TYPEC_USB-: length 24.3
  Top Layer w0.254: v2(23.3,23.3) 22.86,23.75 U1.13 ; 27.94,6.1 27.94,6.09 27.94,5.08 27.69,4.83 27.18,4.83 26.94,5.07 26.94,7.1 v2(26.54,7.49)
  Bottom Layer w0.254: v2(23.3,23.3) 25.15,21.46 25.15,8.89 v2(26.54,7.49)
U0RXD: length 6.6
  Bottom Layer w0.254: R.1 13.7,41.91 v2(12.7,42.91)
U0TXD: length 6.3
  Bottom Layer w0.254: v2(11.43,42.91) 11.16,42.65 T.1
$1N2410: length 2
  Top Layer w0.254: R8.2 LED5.1
$1N3847: length 7.2
  Top Layer w0.254: R9.2 22.11,4.31 22.73,3.68 25.91,3.68 26.44,4.21 26.44,6.1
$1N3906: length 6.2
  Top Layer w0.254: R7.1 33.54,4.06 30.23,4.06 29.44,4.85 29.44,6.1
$1N6588: length 3.6
  Top Layer w0.254: R6.2 31.07,14.91 29.52,14.91 29.34,14.73 29.34,13.58 U2.5
$1N6592: length 15.5
  Top Layer w0.254: R5.2 38.85,21.47 38.48,21.84 36.45,21.84 36.27,21.66 36.27,21.03 36.07,20.83 36.07,16.56 35.97,16.45 35.97,15.52 34.67,14.22 34.04,14.22 33.66,13.84 33.66,12.32 34.04,11.94 34.79,11.94
$1N6593: length 3.4
  Top Layer w0.254: LED2.2 37.3,17.65 LED1.1 37.35,19.22 R5.1
$1N6594:
  vias: v2(32.78,20.8) v2(32.8,19.55) v2(32.73,18.21) v2(32.78,16.86) v2(33.85,20.8) v2(33.85,19.55) v2(33.85,18.21) v2(33.85,16.86) v2(34.38,9.22) v2(34.79,9.81) v2(35.29,9.22)
$1N6595: length 12.2
  Top Layer w0.254: U2.4 36.07,13.21 36.32,13.46 36.32,16.31 36.7,16.69 38.9,16.69 ; 38.9,16.69 v2(38.9,15.88) 38.9,14.35 LED4.1 ; 38.9,16.69 LED1.2
$1N6596: length 4
  Top Layer w0.254: R4.1 37.17,14.13 LED4.2 37.3,14.35 LED3.1
$1N6597: length 4
  Top Layer w0.254: U2.2 36.7,10.67 37.22,11.18 R4.2

## Copper pours and planes (outline as drawn; the poured copper is in the pictures)
GND on Top Layer: -0.13,98.17 40.13,98.17 40.13,-5.59 -0.13,-5.59
GND on Bottom Layer: 0,98.04 39.75,98.04 39.75,-2.16 0,-2.16
BAT on Top Layer: 24.13,22.1 30.61,22.1 30.61,11.56 24.13,11.56
$1N6594 on Bottom Layer: 31.88,21.84 35.81,21.84 35.81,8.76 31.88,8.76

Small or netless copper shapes (teardrops, artwork), in the pictures only: 85 on Top Layer, 28 on Bottom Layer

## Text on the board
Bottom Solder Mask Layer: www.silverdragon.cn
Bottom Silkscreen Layer: 麟云电科
Top Silkscreen Layer: JLCJLCJLCJLC | 左眨眼 | 右眨眼 | 眨眼同步 | R1       R2
